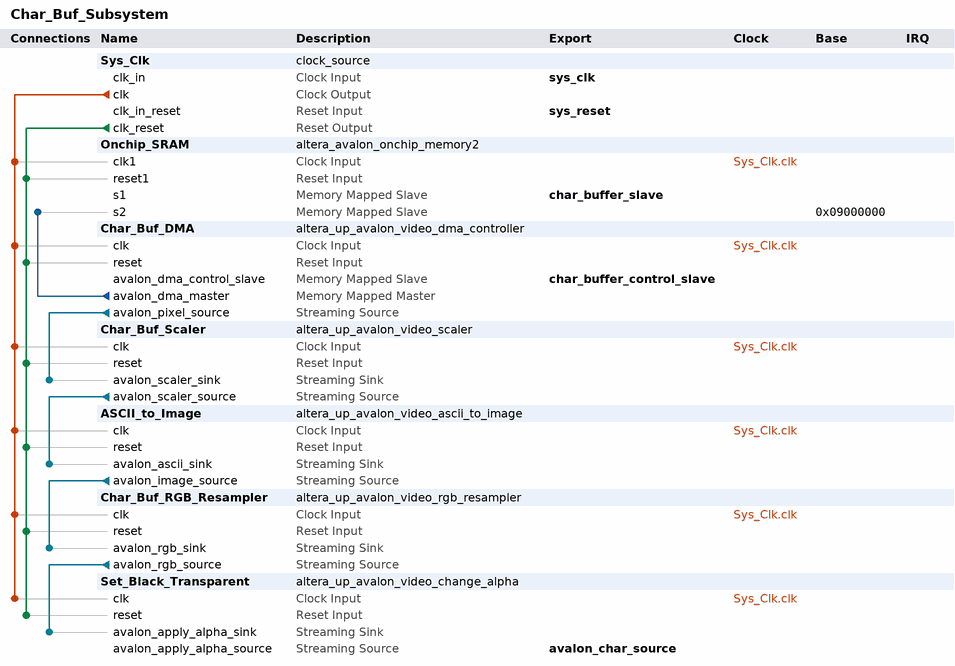
[diagram p0: system contents]
# Platform Designer (Qsys) system Char_Buf_Subsystem, Cyclone V 5CSEMA5F31C6
# Parameters at their usual value, and those the tool derives, are not listed.
package require -exact qsys 18.0
create_system Char_Buf_Subsystem
set_project_property DEVICE_FAMILY {Cyclone V}
set_project_property DEVICE 5CSEMA5F31C6

add_instance Sys_Clk clock_source 18.1
set_instance_parameter_value Sys_Clk clockFrequency 50000000
set_instance_parameter_value Sys_Clk clockFrequencyKnown false

add_instance Onchip_SRAM altera_avalon_onchip_memory2 18.1
set_instance_parameter_value Onchip_SRAM dataWidth 32
set_instance_parameter_value Onchip_SRAM dualPort true
set_instance_parameter_value Onchip_SRAM initMemContent true
set_instance_parameter_value Onchip_SRAM initializationFileName onchip_mem.hex
set_instance_parameter_value Onchip_SRAM memorySize 8192
set_instance_parameter_value Onchip_SRAM singleClockOperation true

add_instance Char_Buf_DMA altera_up_avalon_video_dma_controller 18.0
set_instance_parameter_value Char_Buf_DMA addr_mode X-Y
set_instance_parameter_value Char_Buf_DMA back_start_address 150994944
set_instance_parameter_value Char_Buf_DMA color_bits 8
set_instance_parameter_value Char_Buf_DMA color_planes 1
set_instance_parameter_value Char_Buf_DMA dma_enabled true
set_instance_parameter_value Char_Buf_DMA height 60
set_instance_parameter_value Char_Buf_DMA mode {From Memory to Stream}
set_instance_parameter_value Char_Buf_DMA start_address 150994944
set_instance_parameter_value Char_Buf_DMA width 80

add_instance Char_Buf_Scaler altera_up_avalon_video_scaler 18.0
set_instance_parameter_value Char_Buf_Scaler color_bits 8
set_instance_parameter_value Char_Buf_Scaler color_planes 1
set_instance_parameter_value Char_Buf_Scaler height_in 60
set_instance_parameter_value Char_Buf_Scaler height_scaling 8
set_instance_parameter_value Char_Buf_Scaler include_channel true
set_instance_parameter_value Char_Buf_Scaler width_in 80
set_instance_parameter_value Char_Buf_Scaler width_scaling 8

add_instance ASCII_to_Image altera_up_avalon_video_ascii_to_image 18.0
set_instance_parameter_value ASCII_to_Image colour_format {1-bit Black/White}

add_instance Char_Buf_RGB_Resampler altera_up_avalon_video_rgb_resampler 18.0
set_instance_parameter_value Char_Buf_RGB_Resampler alpha 1023
set_instance_parameter_value Char_Buf_RGB_Resampler input_type {1-bit Black/White}
set_instance_parameter_value Char_Buf_RGB_Resampler output_type {40-bit RGBA}

add_instance Set_Black_Transparent altera_up_avalon_video_change_alpha 18.0
set_instance_parameter_value Set_Black_Transparent alpha 0
set_instance_parameter_value Set_Black_Transparent color 0
set_instance_parameter_value Set_Black_Transparent color_bits 10
set_instance_parameter_value Set_Black_Transparent color_planes 4

# connections
add_connection Sys_Clk.clk ASCII_to_Image.clk clock
add_connection Sys_Clk.clk Char_Buf_DMA.clk clock
add_connection Sys_Clk.clk Char_Buf_RGB_Resampler.clk clock
add_connection Sys_Clk.clk Char_Buf_Scaler.clk clock
add_connection Sys_Clk.clk Onchip_SRAM.clk1 clock
add_connection Sys_Clk.clk Set_Black_Transparent.clk clock
add_connection Sys_Clk.clk_reset ASCII_to_Image.reset reset
add_connection Sys_Clk.clk_reset Char_Buf_DMA.reset reset
add_connection Sys_Clk.clk_reset Char_Buf_RGB_Resampler.reset reset
add_connection Sys_Clk.clk_reset Char_Buf_Scaler.reset reset
add_connection Sys_Clk.clk_reset Onchip_SRAM.reset1 reset
add_connection Sys_Clk.clk_reset Set_Black_Transparent.reset reset
add_connection Char_Buf_DMA.avalon_dma_master Onchip_SRAM.s2 avalon
set_connection_parameter_value Char_Buf_DMA.avalon_dma_master/Onchip_SRAM.s2 baseAddress 0x09000000
add_connection ASCII_to_Image.avalon_image_source Char_Buf_RGB_Resampler.avalon_rgb_sink avalon_streaming
add_connection Char_Buf_DMA.avalon_pixel_source Char_Buf_Scaler.avalon_scaler_sink avalon_streaming
add_connection Char_Buf_RGB_Resampler.avalon_rgb_source Set_Black_Transparent.avalon_apply_alpha_sink avalon_streaming
add_connection Char_Buf_Scaler.avalon_scaler_source ASCII_to_Image.avalon_ascii_sink avalon_streaming

# exported interfaces
add_interface avalon_char_source avalon_streaming source
set_interface_property avalon_char_source EXPORT_OF Set_Black_Transparent.avalon_apply_alpha_source
add_interface char_buffer_control_slave avalon slave
set_interface_property char_buffer_control_slave EXPORT_OF Char_Buf_DMA.avalon_dma_control_slave
add_interface char_buffer_slave avalon slave
set_interface_property char_buffer_slave EXPORT_OF Onchip_SRAM.s1
add_interface sys_clk clock sink
set_interface_property sys_clk EXPORT_OF Sys_Clk.clk_in
add_interface sys_reset reset sink
set_interface_property sys_reset EXPORT_OF Sys_Clk.clk_in_reset

set_interconnect_requirement {$system} qsys_mm.clockCrossingAdapter HANDSHAKE
set_interconnect_requirement {$system} qsys_mm.enableEccProtection FALSE
set_interconnect_requirement {$system} qsys_mm.insertDefaultSlave FALSE
set_interconnect_requirement {$system} qsys_mm.maxAdditionalLatency 1

save_system Char_Buf_Subsystem.qsys
